# Altium project NFC_tag.PrjPCB
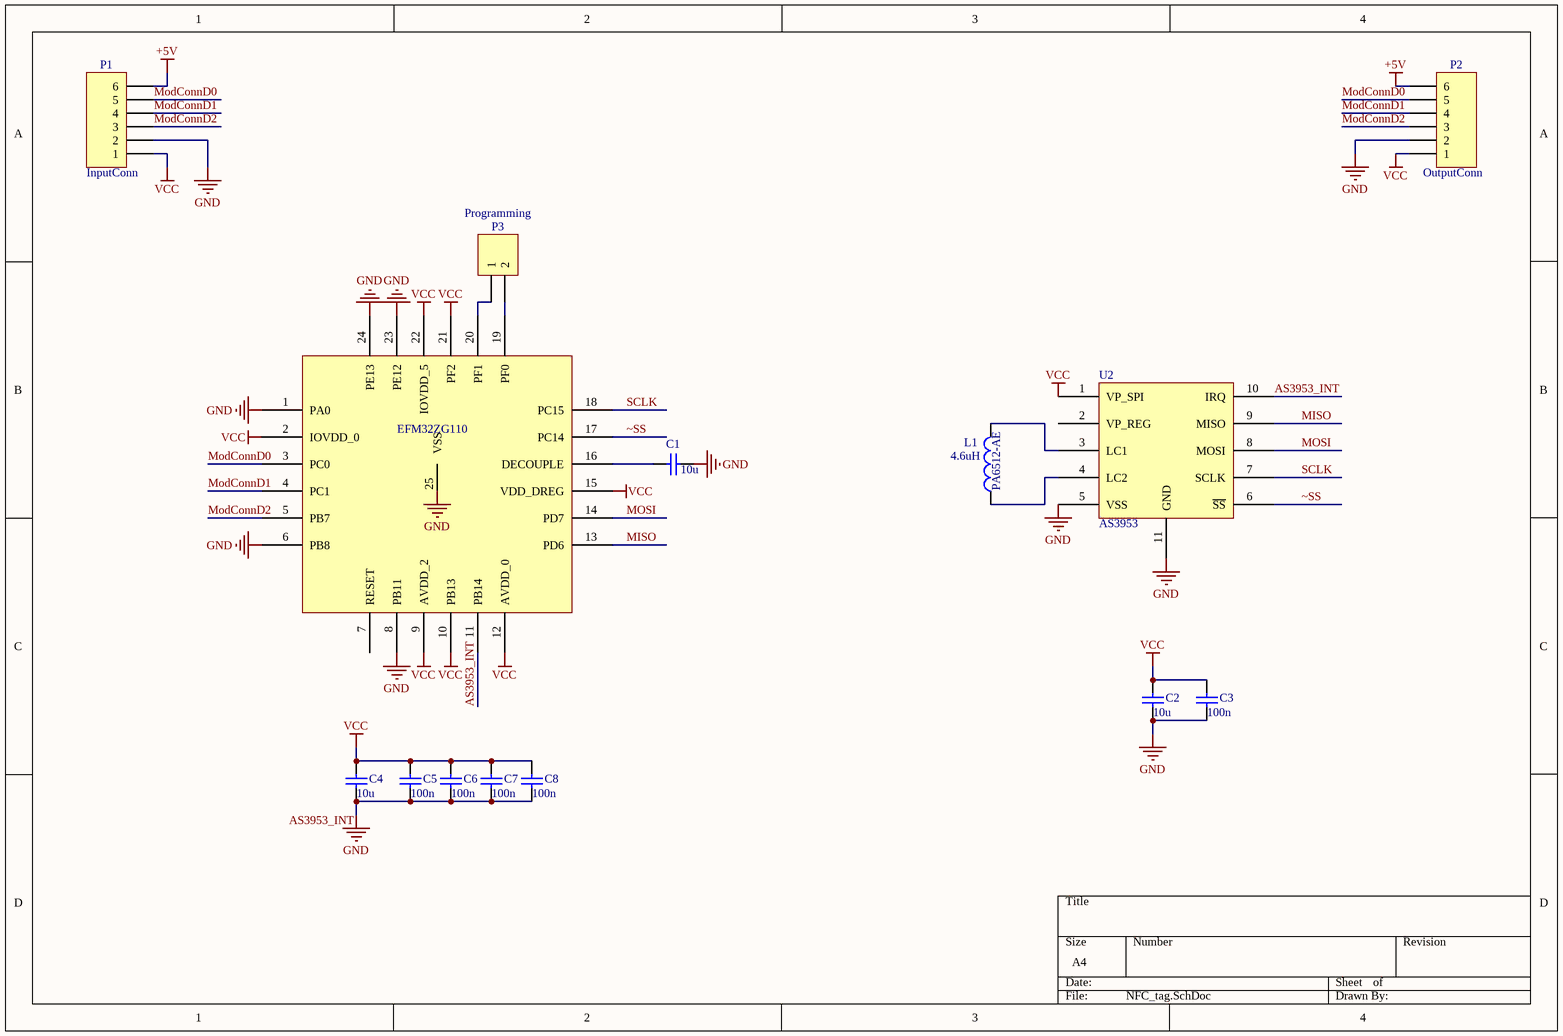
[diagram p0: NFC_tag.SchDoc]
1 sheet, 14 parts. Net scope: global (net labels, ports and power ports of the same name join across sheets).
Board file: NFC_tag.PcbDoc

## Sheet NFC_tag.SchDoc
size A4

### Parts
C1  10u  [0805]
C2  10u  [0805]
C3  value 100n  [0402]  (hidden comment: Cap Semi)
C4  10u  [0805]
C5  value 100n  [0402]  (hidden comment: Cap Semi)
C6  value 100n  [0402]  (hidden comment: Cap Semi)
C7  value 100n  [0402]  (hidden comment: Cap Semi)
C8  value 100n  [0402]  (hidden comment: Cap Semi)
L1  PA6512-AE  value 4.6uH  [Coil_PA6512-AE]
P1  InputConn  [Goldpin6_1.27mm]
P2  OutputConn  [Goldpin6_1.27mm]
P3  Programming  [GeckoProgramming]
U1  EFM32ZG110  [QFN24_5x5_0.65]
U2  AS3953  [DFN10_3x3x0.5]

### Nets
+5V: P1.6 P2.6
GND: C1.1 C2.1 C3.1 C4.1 C5.1 C6.1 C7.1 C8.1 P1.2 P2.2 U1.1(PA0) U1.6(PB8) U1.8(PB11) U1.23(PE12) U1.24(PE13) U1.25(VSS) U2.5(VSS) U2.11(GND)
VCC: C2.2 C3.2 C4.2 C5.2 C6.2 C7.2 C8.2 P1.1 P2.1 U1.2(IOVDD_0) U1.9(AVDD_2) U1.10(PB13) U1.12(AVDD_0) U1.15(VDD_DREG) U1.21(PF2) U1.22(IOVDD_5) U2.1(VP_SPI)
AS3953_INT: U1.11(PB14) U2.10(IRQ)
MISO: U1.13(PD6) U2.9(MISO)
ModConnD0: P1.5 P2.5 U1.3(PC0)
ModConnD1: P1.4 P2.4 U1.4(PC1)
ModConnD2: P1.3 P2.3 U1.5(PB7)
MOSI: U1.14(PD7) U2.8(MOSI)
SCLK: U1.18(PC15) U2.7(SCLK)
~SS: U1.17(PC14) U2.6(~{SS})
NetC1_2: C1.2 U1.16(DECOUPLE)
NetL1_1: L1.1 U2.4(LC2)
NetL1_2: L1.2 U2.3(LC1)
NetP3_1: P3.1 U1.20(PF1)
NetP3_2: P3.2 U1.19(PF0)

Not connected (* = marked no-connect by the designer): U1 7(RESET); U2 2(VP_REG)

### Notes on the sheet
- Labels drawn without touching a wire or pin: AS3953_INT

### Library data of the parts
C1-C8 = Cap Semi: Capacitor (Semiconductor SIM Model); Published: 8-Jun-2000; LatestRevisionDate: 29-May-2009; LatestRevisionNote: IPC-7351 Footprint Added.; PackageReference: C1206; Publisher: Altium Limited; PackageDescription: Chip Capacitor
  C1 C2 C4: Value: 10u
L1 = Inductor: Code_IEC: 1005; Published: 8-Jun-2000; LatestRevisionDate: 29-May-2009; LatestRevisionNote: IPC-7351 Footprint Added.; PackageReference: 0402-A; Publisher: Altium Limited; PackageDescription: Chip Inductor; Code_JEITA: 0402
P1 P2 = MHDR1X6: Header, 6-Pin; LatestRevisionDate: 17-Jul-2002; LatestRevisionNote: Re-released for DXP Platform.; Publisher: Altium Limited
P3 = MHDR1X2: Header, 2-Pin; LatestRevisionDate: 17-Jul-2002; LatestRevisionNote: Re-released for DXP Platform.; Publisher: Altium Limited